# Altium project as14120.PrjPCB (part 1 of 2)
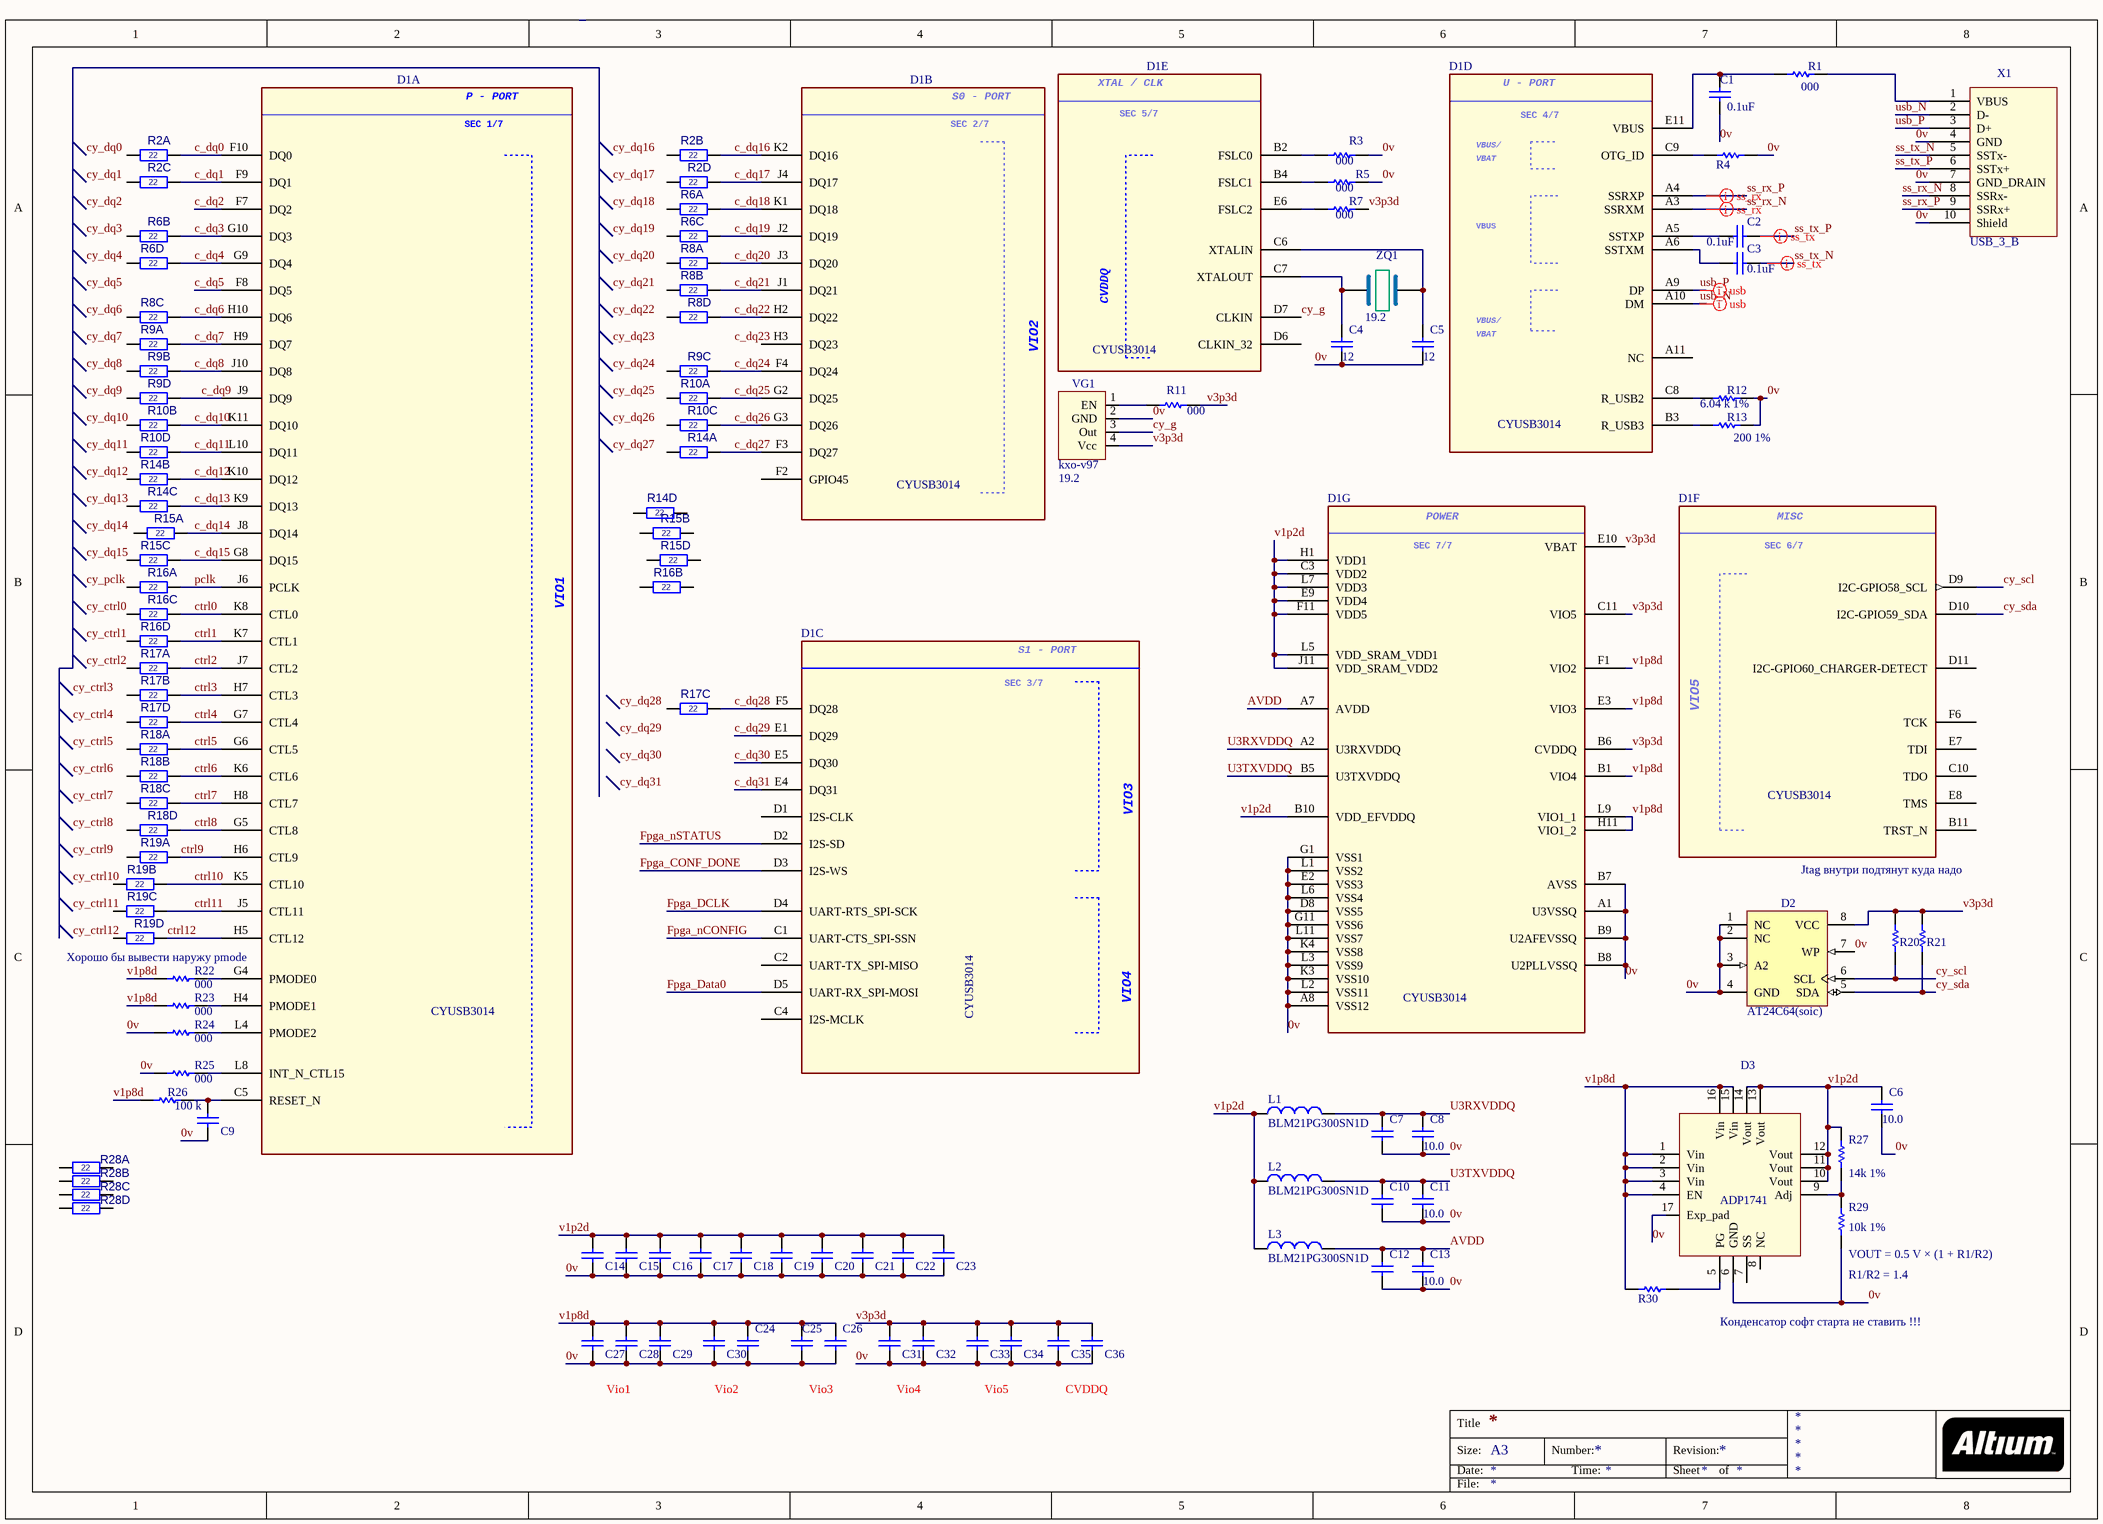
[diagram p0: as14120_usb.SchDoc]
7 sheets, 252 parts. Net scope: global (net labels, ports and power ports of the same name join across sheets).
Board file: as14120_all.PcbDoc
Sheets:
  as14120_usb.SchDoc
  as14120_ddr.SchDoc
  as14120_fpga_ttl.SchDoc
  as14120_fpga_ddr.SchDoc
  as14120_fpga_power_conf.SchDoc
  as14120_fpga_cypress.SchDoc
  as14120_fpga_adc.SchDoc

## Sheet as14120_usb.SchDoc
size A3; PageSetup: Record=PageOptions|CenterHorizontal=True|CenterVertical=True|PrintScale=0.91|XCorrection=1.00|YCorrection=1.00|PrintKind=0|BorderSize=5000000|LeftOffset=0|BottomOffset=0|Orientation=2|PaperLength=4200|PaperWidth=2970|Scale=100|PaperSource=7|PrintQuality=-4|MediaType=1|DitherType=10|PaperKind=A4 (210 x 297 мм)|PrintScaleMode=1

### Parts
C1  value 0.1uF  [CAPC0402(1005)60_M]  (hidden comment: CAP 1uF 10V 0402(1005))
C2  value 0.1uF  [CAPC0402(1005)60_M]  (hidden comment: CAP 1uF 10V 0402(1005))
C3  value 0.1uF  [CAPC0402(1005)60_M]  (hidden comment: CAP 1uF 10V 0402(1005))
C4  value 12  [CAPC0805(2012)100_N]  (hidden comment: CAP_0805)
C5  value 12  [CAPC0805(2012)100_N]  (hidden comment: CAP_0805)
C6  value 10.0  [CAPC0805(2012)100_N]  (hidden comment: CAP_0805)
C7  CAP 1uF 10V 0402(1005)  [CAPC0402(1005)60_M]  (value not drawn)
C8  value 10.0  [CAPC0805(2012)100_N]  (hidden comment: CAP_0805)
C9  CAP 1uF 10V 0402(1005)  [CAPC0402(1005)60_M]  (value not drawn)
C10  CAP 1uF 10V 0402(1005)  [CAPC0402(1005)60_M]  (value not drawn)
C11  value 10.0  [CAPC0805(2012)100_N]  (hidden comment: CAP_0805)
C12  CAP 1uF 10V 0402(1005)  [CAPC0402(1005)60_M]  (value not drawn)
C13  value 10.0  [CAPC0805(2012)100_N]  (hidden comment: CAP_0805)
C14  CAP 1uF 10V 0402(1005)  [CAPC0402(1005)60_M]  (value not drawn)
C15  CAP 1uF 10V 0402(1005)  [CAPC0402(1005)60_M]  (value not drawn)
C16  CAP 1uF 10V 0402(1005)  [CAPC0402(1005)60_M]  (value not drawn)
C17  CAP 1uF 10V 0402(1005)  [CAPC0402(1005)60_M]  (value not drawn)
C18  CAP 1uF 10V 0402(1005)  [CAPC0402(1005)60_M]  (value not drawn)
C19  CAP 1uF 10V 0402(1005)  [CAPC0402(1005)60_M]  (value not drawn)
C20  CAP 1uF 10V 0402(1005)  [CAPC0402(1005)60_M]  (value not drawn)
C21  CAP 1uF 10V 0402(1005)  [CAPC0402(1005)60_M]  (value not drawn)
C22  CAP 1uF 10V 0402(1005)  [CAPC0402(1005)60_M]  (value not drawn)
C23  CAP 1uF 10V 0402(1005)  [CAPC0402(1005)60_M]  (value not drawn)
C24  CAP 1uF 10V 0402(1005)  [CAPC0402(1005)60_M]  (value not drawn)
C25  CAP 1uF 10V 0402(1005)  [CAPC0402(1005)60_M]  (value not drawn)
C26  CAP 1uF 10V 0402(1005)  [CAPC0402(1005)60_M]  (value not drawn)
C27  CAP 1uF 10V 0402(1005)  [CAPC0402(1005)60_M]  (value not drawn)
C28  CAP 1uF 10V 0402(1005)  [CAPC0402(1005)60_M]  (value not drawn)
C29  CAP 1uF 10V 0402(1005)  [CAPC0402(1005)60_M]  (value not drawn)
C30  CAP 1uF 10V 0402(1005)  [CAPC0402(1005)60_M]  (value not drawn)
C31  CAP 1uF 10V 0402(1005)  [CAPC0402(1005)60_M]  (value not drawn)
C32  CAP 1uF 10V 0402(1005)  [CAPC0402(1005)60_M]  (value not drawn)
C33  CAP 1uF 10V 0402(1005)  [CAPC0402(1005)60_M]  (value not drawn)
C34  CAP 1uF 10V 0402(1005)  [CAPC0402(1005)60_M]  (value not drawn)
C35  CAP 1uF 10V 0402(1005)  [CAPC0402(1005)60_M]  (value not drawn)
C36  CAP 1uF 10V 0402(1005)  [CAPC0402(1005)60_M]  (value not drawn)
D1  CYUSB3014  [BGA121C80P11X11]  (parts A,B,C,D,E,F,G of 7)
D2  AT24C64(soic)  [8S1_N]
D3  ADP1741  [CP-16-4_N]
L1  BLM21PG300SN1D  [CAPC0805(2012)100_N]
L2  BLM21PG300SN1D  [CAPC0805(2012)100_N]
L3  BLM21PG300SN1D  [CAPC0805(2012)100_N]
R1  value 000  [RESC0805(2012)_L]  (hidden comment: 1K 1% 0805(2012))
R2  value 22  [CAY16]  (hidden comment: RES_CAY16)  (parts A,B,C,D of 4)
R3  value 000  [RESC0603(1608)_L]  (hidden comment: 1K 5% 0603(1608))
R4  ???  [RESC0603(1608)_L]  (value not drawn)
R5  value 000  [RESC0603(1608)_L]  (hidden comment: 1K 5% 0603(1608))
R6  value 22  [CAY16]  (hidden comment: RES_CAY16)  (parts A,B,C,D of 4)
R7  value 000  [RESC0603(1608)_L]  (hidden comment: 1K 5% 0603(1608))
R8  value 22  [CAY16]  (hidden comment: RES_CAY16)  (parts A,B,C,D of 4)
R9  value 22  [CAY16]  (hidden comment: RES_CAY16)  (parts A,B,C,D of 4)
R10  value 22  [CAY16]  (hidden comment: RES_CAY16)  (parts A,B,C,D of 4)
R11  value 000  [RESC0603(1608)_L]  (hidden comment: 1K 5% 0603(1608))
R12  value 6.04 k 1%  [RESC0805(2012)_L]  (hidden comment: 1K 1% 0805(2012))
R13  value 200 1%  [RESC0805(2012)_L]  (hidden comment: 1K 1% 0805(2012))
R14  value 22  [CAY16]  (hidden comment: RES_CAY16)  (parts A,B,C,D of 4)
R15  value 22  [CAY16]  (hidden comment: RES_CAY16)  (parts A,B,C,D of 4)
R16  value 22  [CAY16]  (hidden comment: RES_CAY16)  (parts A,B,C,D of 4)
R17  value 22  [CAY16]  (hidden comment: RES_CAY16)  (parts A,B,C,D of 4)
R18  value 22  [CAY16]  (hidden comment: RES_CAY16)  (parts A,B,C,D of 4)
R19  value 22  [CAY16]  (hidden comment: RES_CAY16)  (parts A,B,C,D of 4)
R20  1K 5% 0603(1608)  [RESC0603(1608)_L]  (value not drawn)
R21  1K 5% 0603(1608)  [RESC0603(1608)_L]  (value not drawn)
R22  value 000  [RESC0603(1608)_L]  (hidden comment: 1K 5% 0603(1608))
R23  value 000  [RESC0603(1608)_L]  (hidden comment: 1K 5% 0603(1608))
R24  value 000  [RESC0603(1608)_L]  (hidden comment: 1K 5% 0603(1608))
R25  value 000  [RESC0603(1608)_L]  (hidden comment: 1K 5% 0603(1608))
R26  value 100 k  [RESC0603(1608)_L]  (hidden comment: 1K 5% 0603(1608))
R27  value 14k 1%  [RESC0805(2012)_L]  (hidden comment: 1K 1% 0805(2012))
R28  value 22  [CAY16]  (hidden comment: RES_CAY16)  (parts A,B,C,D of 4)
R29  value 10k 1%  [RESC0805(2012)_L]  (hidden comment: 1K 1% 0805(2012))
R30  1K 5% 0603(1608)  [RESC0603(1608)_L]  (value not drawn)
VG1  kxo-v97  value 19.2  [kxo-v97]
X1  USB_3_B  [USB3_B]
ZQ1  value 19.2  [BCY-W2/E4.7]  (hidden comment: Resonator)

### Nets
0v: C1.2 C4.1 C5.1 C6.1 C7.1 C8.1 C9.1 C10.1 C11.1 C12.1 C13.1 C14.1 C15.1 C16.1 C17.1 C18.1 C19.1 C20.1 C21.1 C22.1 C23.1 C24.1 C25.1 C26.1 C27.1 C28.1 C29.1 C30.1 C31.1 C32.1 C33.1 C34.1 C35.1 C36.1 D1.A1(U3VSSQ) D1.A8(VSS12) D1.B7(AVSS) D1.B8(U2PLLVSSQ) D1.B9(U2AFEVSSQ) D1.D8(VSS5) D1.E2(VSS3) D1.G1(VSS1) D1.G11(VSS6) D1.K3(VSS10) D1.K4(VSS8) D1.L1(VSS2) D1.L2(VSS11) D1.L3(VSS9) D1.L6(VSS4) D1.L11(VSS7) D2.1(NC) D2.2(NC) D2.3(A2) D2.4(GND) D2.7(WP) D3.6(GND) D3.17(Exp_pad) R3.1 R4.2 R5.1 R12.2 R13.2 R24.2 R25.2 R29.1 VG1.2(GND) X1.4(GND) X1.7(GND_DRAIN) X1.10(Shield)
AVDD: C12.2 C13.2 D1.A7(AVDD) L3.2
c_dq0: D1.F10(DQ0) R2.8
c_dq1: D1.F9(DQ1) R2.6
c_dq2: D1.F7(DQ2)
c_dq3: D1.G10(DQ3) R6.7
c_dq4: D1.G9(DQ4) R6.8
c_dq5: D1.F8(DQ5)
c_dq6: D1.H10(DQ6) R8.6
c_dq7: D1.H9(DQ7) R9.8
c_dq8: D1.J10(DQ8) R9.7
c_dq9: D1.J9(DQ9) R9.8
c_dq10: D1.K11(DQ10) R10.7
c_dq11: D1.L10(DQ11) R10.8
c_dq12: D1.K10(DQ12) R14.7
c_dq13: D1.K9(DQ13) R14.6
c_dq14: D1.J8(DQ14) R15.8
c_dq15: D1.G8(DQ15) R15.7
c_dq16: D1.K2(DQ16) R2.7
c_dq17: D1.J4(DQ17) R2.5
c_dq18: D1.K1(DQ18) R6.8
c_dq19: D1.J2(DQ19) R6.6
c_dq20: D1.J3(DQ20) R8.7
c_dq21: D1.J1(DQ21) R8.6
c_dq22: D1.H2(DQ22) R8.5
c_dq24: D1.F4(DQ24) R9.7
c_dq25: D1.G2(DQ25) R10.8
c_dq26: D1.G3(DQ26) R10.6
c_dq27: D1.F3(DQ27) R14.8
c_dq28: D1.F5(DQ28) R17.6
c_dq29: D1.E1(DQ29)
c_dq30: D1.E5(DQ30)
c_dq31: D1.E4(DQ31)
ctrl0: D1.K8(CTL0) R16.6
ctrl1: D1.K7(CTL1) R16.5
ctrl2: D1.J7(CTL2) R17.8
ctrl3: D1.H7(CTL3) R17.7
ctrl4: D1.G7(CTL4) R17.5
ctrl5: D1.G6(CTL5) R18.8
ctrl6: D1.K6(CTL6) R18.7
ctrl7: D1.H8(CTL7) R18.7
ctrl8: D1.G5(CTL8) R18.5
ctrl9: D1.H6(CTL9) R19.5
ctrl10: D1.K5(CTL10) R19.7
ctrl11: D1.J5(CTL11) R19.6
ctrl12: D1.H5(CTL12) R19.5
cy_g: D1.D7(CLKIN) VG1.3(Out)
cy_scl: D1.D9(I2C-GPIO58_SCL) D2.6(SCL) R20.1
cy_sda: D1.D10(I2C-GPIO59_SDA) D2.5(SDA) R21.1
Fpga_CONF_DONE: D1.D3(I2S-WS)
Fpga_Data0: D1.D5(UART-RX_SPI-MOSI)
Fpga_DCLK: D1.D4(UART-RTS_SPI-SCK)
Fpga_nCONFIG: D1.C1(UART-CTS_SPI-SSN)
Fpga_nSTATUS: D1.D2(I2S-SD)
pclk: D1.J6(PCLK) R16.8
ss_rx_N: D1.A3(SSRXM) X1.8(SSRx-)
ss_rx_P: D1.A4(SSRXP) X1.9(SSRx+)
ss_tx_N: C3.1 X1.5(SSTx-)
ss_tx_P: C2.1 X1.6(SSTx+)
U3RXVDDQ: C7.2 C8.2 D1.A2(U3RXVDDQ) L1.2
U3TXVDDQ: C10.2 C11.2 D1.B5(U3TXVDDQ) L2.2
usb_N: D1.A10(DM) X1.2(D-)
usb_P: D1.A9(DP) X1.3(D+)
v1p2d: C6.2 C14.2 C15.2 C16.2 C17.2 C18.2 C19.2 C20.2 C21.2 C22.2 C23.2 D1.B10(VDD_EFVDDQ) D1.C3(VDD2) D1.E9(VDD4) D1.F11(VDD5) D1.H1(VDD1) D1.J11(VDD_SRAM_VDD2) D1.L5(VDD_SRAM_VDD1) D1.L7(VDD3) D3.10(Vout) D3.11(Vout) D3.12(Vout) D3.13(Vout) D3.14(Vout) L1.1 L2.1 L3.1 R27.2
v1p8d: C24.2 C25.2 C26.2 C27.2 C28.2 C29.2 C30.2 D1.B1(VIO4) D1.E3(VIO3) D1.F1(VIO2) D1.H11(VIO1_2) D1.L9(VIO1_1) D3.1(Vin) D3.2(Vin) D3.3(Vin) D3.4(EN) D3.15(Vin) D3.16(Vin) R22.2 R23.2 R26.2 R30.2
v3p3d: C31.2 C32.2 C33.2 C34.2 C35.2 C36.2 D1.B6(CVDDQ) D1.C11(VIO5) D1.E10(VBAT) D2.8(VCC) R7.1 R11.1 R20.2 R21.2 VG1.4(Vcc)
NetC1_1: C1.1 D1.E11(VBUS) R1.1
NetC2_2: C2.2 D1.A5(SSTXP)
NetC3_2: C3.2 D1.A6(SSTXM)
NetC4_2: C4.2 D1.C7(XTALOUT) ZQ1.1
NetC5_2: C5.2 D1.C6(XTALIN) ZQ1.2
NetC9_2: C9.2 D1.C5(RESET_N) R26.1
NetD1_B2: D1.B2(FSLC0) R3.2
NetD1_B3: D1.B3(R_USB3) R13.1
NetD1_B4: D1.B4(FSLC1) R5.2
NetD1_C8: D1.C8(R_USB2) R12.1
NetD1_C9: D1.C9(OTG_ID) R4.1
NetD1_E6: D1.E6(FSLC2) R7.2
NetD1_G4: D1.G4(PMODE0) R22.1
NetD1_H4: D1.H4(PMODE1) R23.1
NetD1_L4: D1.L4(PMODE2) R24.1
NetD1_L8: D1.L8(INT_N_CTL15) R25.1
NetD3_5: D3.5(PG) R30.1
NetD3_9: D3.9(Adj) R27.1 R29.2
NetR1_2: R1.2 X1.1(VBUS)
NetR11_2: R11.2 VG1.1(EN)

Not connected (* = marked no-connect by the designer): D1 A11(NC) B11(TRST_N) C2(UART-TX_SPI-MISO) C4(I2S-MCLK) C10(TDO) D1(I2S-CLK) D6(CLKIN_32) D11(I2C-GPIO60_CHARGER-DETECT) E7(TDI) E8(TMS) F2(GPIO45) F6(TCK) H3(DQ23); D3 7(SS) 8(NC); R2 1 2(1) 3(1) 4(1); R6 1 2(1) 3(1) 4(1); R8 1 2(1) 3(1) 4(1); R9 1 2(1) 3(1) 4(1); R10 1 2(1) 3(1) 4(1); R14 1 2(1) 3(1) 4(1) 5(2); R15 1 2(1) 3(1) 4(1) 5(2); R16 1 2(1) 3(1) 4(1) 7(2); R17 1 2(1) 3(1) 4(1); R18 1 2(1) 3(1) 4(1); R19 1 2(1) 3(1) 4(1); R28 1 2(1) 3(1) 4(1) 5(2) 6(2) 7(2) 8(2)

### Layout directives
differential pair: ss_rx_N, ss_rx_P, ss_tx_N, ss_tx_P, usb_N, usb_P

### Notes on the sheet
- Jtag внутри подтянут куда надо
- Хорошо бы вывести наружу pmode
- (near R29) VOUT = 0.5 V × (1 + R1/R2)
- R1/R2 = 1.4
- Конденсатор софт старта не ставить !!!
- Vio1
- Vio2
- Vio3
- Vio4
- Vio5
- CVDDQ
- Labels drawn without touching a wire or pin: c_dq23, cy_ctrl0, cy_ctrl1, cy_ctrl2, cy_ctrl3, cy_ctrl4, cy_ctrl5, cy_ctrl6, cy_ctrl7, cy_ctrl8, cy_ctrl9, cy_ctrl10, cy_ctrl11, cy_ctrl12, cy_dq0, cy_dq1, cy_dq2, cy_dq3, cy_dq4, cy_dq5, cy_dq6, cy_dq7, cy_dq8, cy_dq9, cy_dq10, cy_dq11, cy_dq12, cy_dq13, cy_dq14, cy_dq15, cy_dq16, cy_dq17, cy_dq18, cy_dq19, cy_dq20, cy_dq21, cy_dq22, cy_dq23, cy_dq24, cy_dq25, cy_dq26, cy_dq27, cy_dq28, cy_dq29, cy_dq30, cy_dq31, cy_pclk
- Title
- Size:
- Date:
- A3
- Number:
- Time:
- Revision:
- Sheet
- of
- File:
- (in symbol CYUSB3014-BZXC, part A) P - PORT; SEC 1/7; VIO1
- (in symbol CYUSB3014-BZXC, part B) S0 - PORT; SEC 2/7
- (in symbol CYUSB3014-BZXC, part C) S1 - PORT; SEC 3/7
- (in symbol CYUSB3014-BZXC, part D) U - PORT; SEC 4/7; VBUS/
- (in symbol CYUSB3014-BZXC, part E) XTAL / CLK; SEC 5/7
- (in symbol CYUSB3014-BZXC, part F) MISC; SEC 6/7
- (in symbol CYUSB3014-BZXC, part G) POWER; SEC 7/7

### Library data of the parts
C1-C3 C7 C9 C10 C12 C14-C36 = CAP_0402: CAP 1uF 10V ±20% 0402 (1005 Metric) Thickness 0.6mm SMD; Case-Metric: 1005; Case-EIA: 0402; Tolerance: ±20%; Max Thickness: 0.6 mm; Rated Voltage: 10 V; Technology: SMT
  C7 C9 C10 C12 C14-C36: Value: 1uF
D1 = CYUSB3014-BZXC
D2 = AT24C08BN-SP25-T: 8Kbit (1024 x 8), 2-wire Bus Automotive Serial EEPROM with Write Protect, 2.5V, 8-Pin SOIC, Tape & Reel; DatasheetVersion: 8517C,  Jan-2009; PackageVersion: revC, Mar-2005; PackageReference: 8S1; PackageDescription: 8-Lead (0.150" Wide Body), Plastic Gull Wing Small Outline (JEDEC SOIC); Code_JEDEC: MS-012-AA; Code_IPC: SOIC127P600-8; ComponentLink1Description: Manufacturer URL; ComponentLink1URL: http://www.atmel.com/; ComponentLink2Description: Datasheet; ComponentLink2URL: http://www.atmel.com/dyn/resources/prod_documents/doc8517.pdf
L1-L3 = Ferrite_beat
R1 R12 R13 R27 R29 = RES_0805: 1K 0.125W 1% 0805 (2012 Metric)  SMD; Case-Metric: 2012; Case-EIA: 0805; Tolerance: 1 %; Power: 0.125 W; Technology: SMT
R3-R5 R7 R11 R22-R26 = RES_0603: 1K 0.1W 5% 0603 (1608 Metric)  SMD; Case-EIA: 0603; Case-Metric: 1608; Technology: SMT; Tolerance: 5 %; Power: 0.1 W
  R4: Value: ???
R20 R21 = RES_0603: 1K 0.1W 5% 0603 (1608 Metric)  SMD; Case-EIA: 0603; Case-Metric: 1608; Value: 2.2 k; Technology: SMT; Tolerance: 5 %; Power: 0.1 W
R30 = RES_0603: 1K 0.1W 5% 0603 (1608 Metric)  SMD; Case-EIA: 0603; Case-Metric: 1608; Value: 100k; Technology: SMT; Tolerance: 5 %; Power: 0.1 W

## Sheet as14120_ddr.SchDoc
size A3; PageSetup: Record=PageOptions|CenterHorizontal=True|CenterVertical=True|PrintScale=1.56|XCorrection=1.00|YCorrection=1.00|PrintKind=0|BorderSize=5000000|LeftOffset=0|BottomOffset=0|Orientation=2|PaperLength=3060|PaperWidth=2190|Scale=100|PaperSource=7|PrintQuality=-4|MediaType=1|DitherType=10|PaperKind=A4 (без полей) (210 x 297 мм)|PrintScaleMode=1
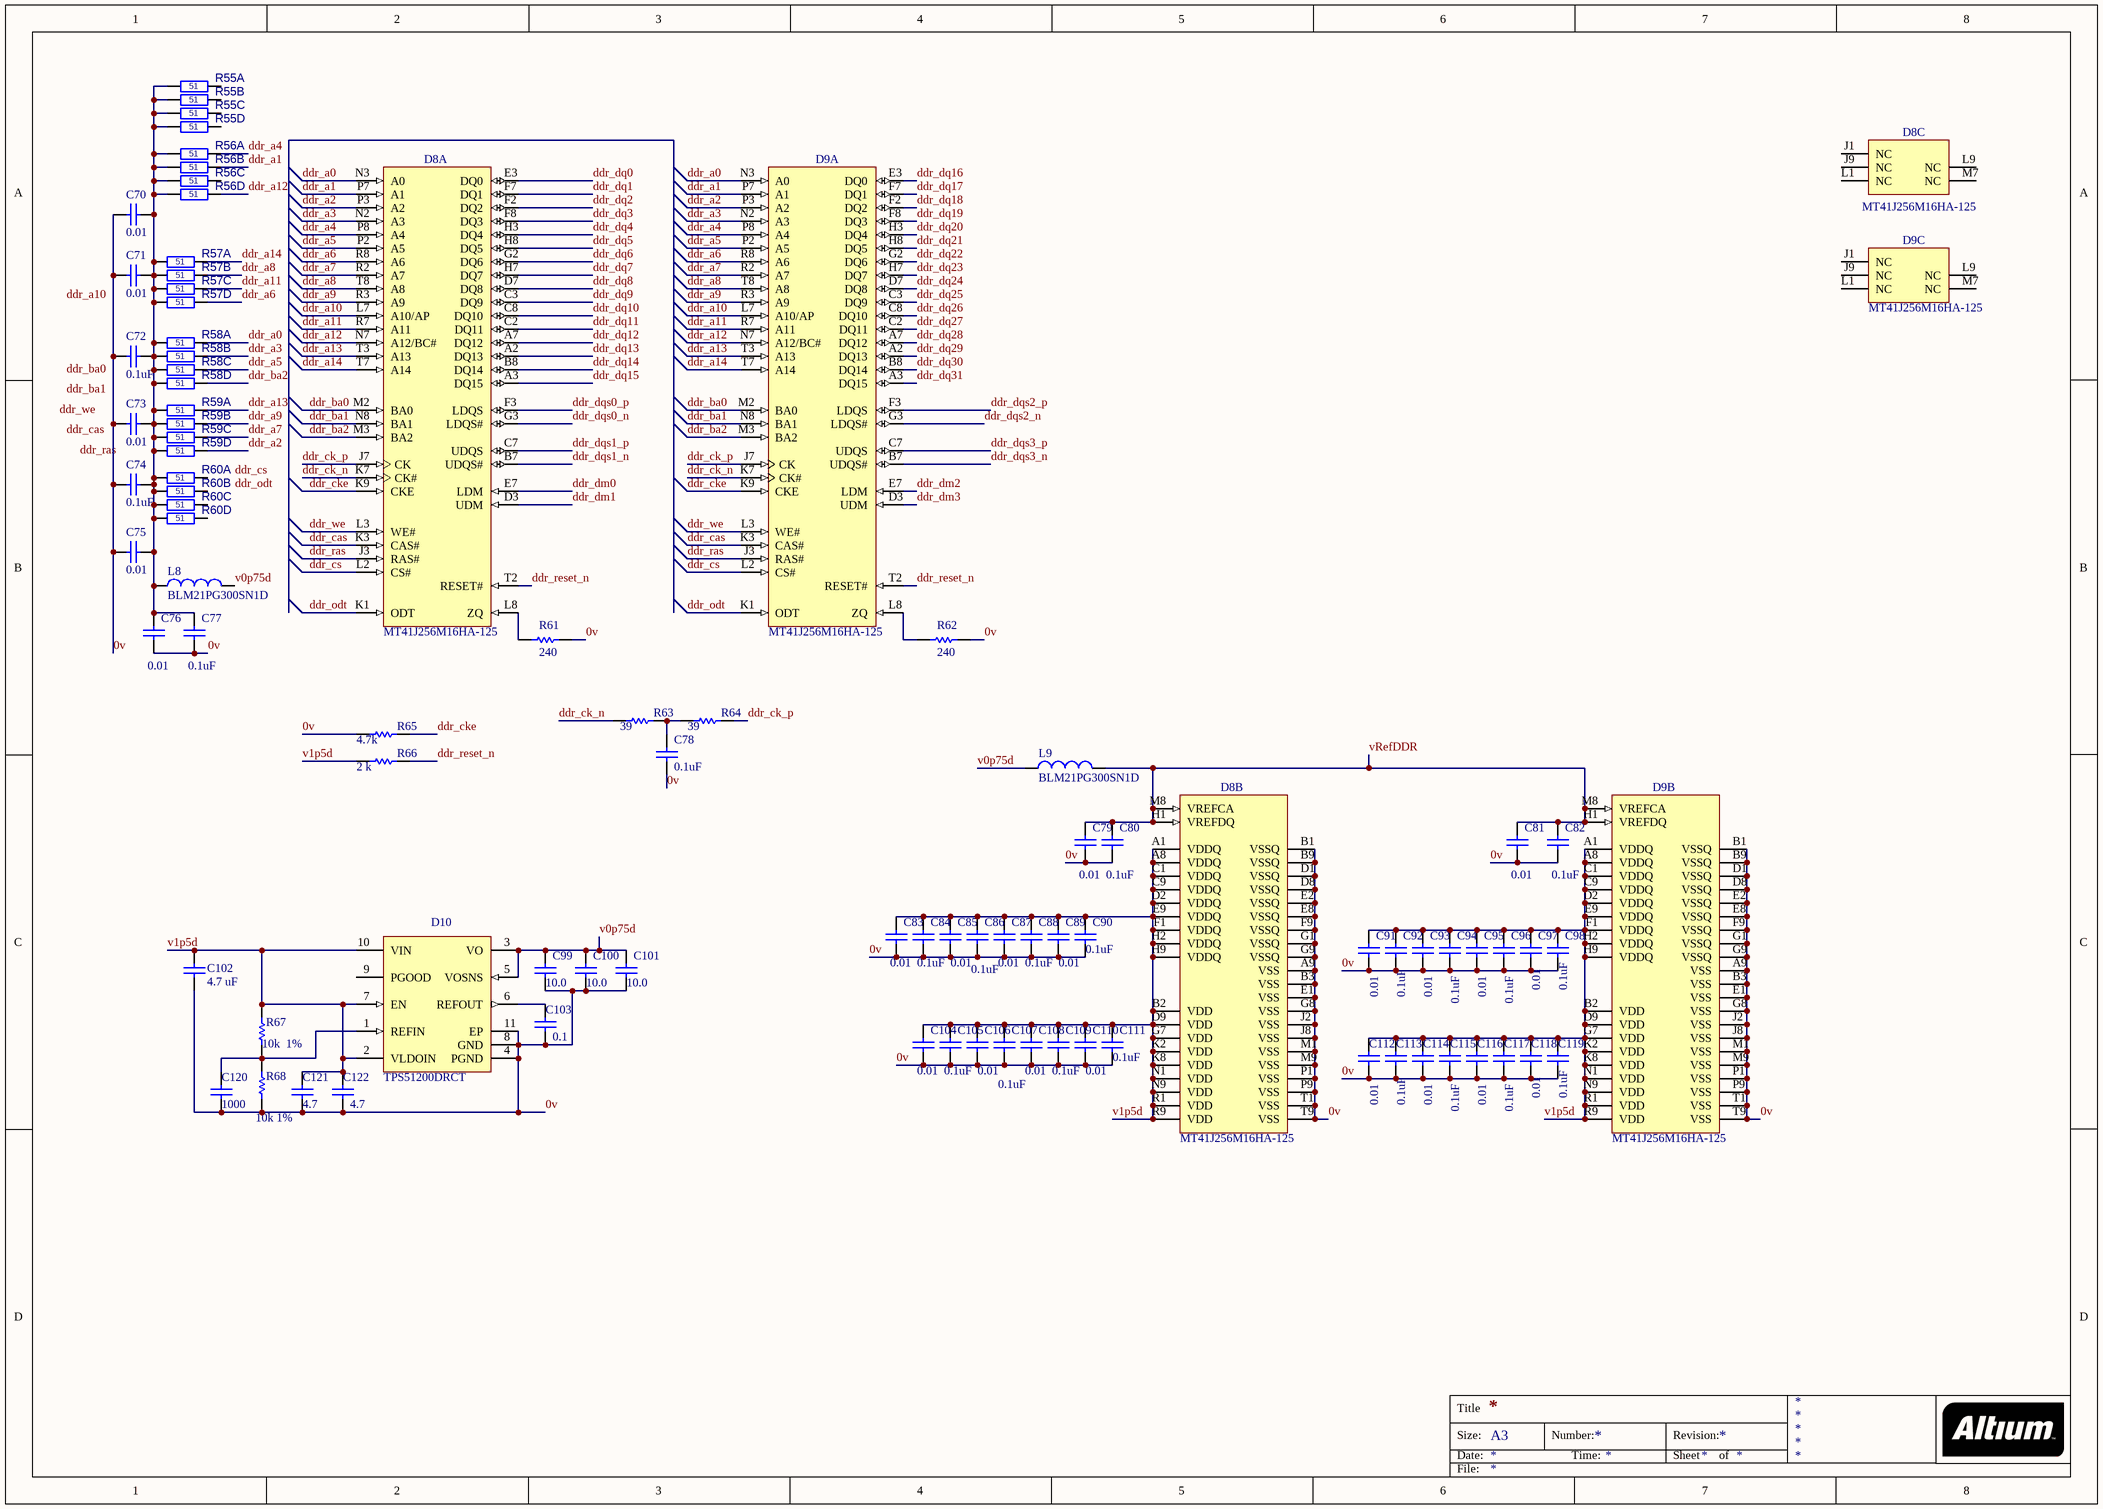
[diagram p1: as14120_ddr.SchDoc]

### Parts
C70  value 0.01  [CAPC0402(1005)60_M]  (hidden comment: CAP 1uF 10V 0402(1005))
C71  value 0.01  [CAPC0402(1005)60_M]  (hidden comment: CAP 1uF 10V 0402(1005))
C72  value 0.1uF  [CAPC0402(1005)60_M]  (hidden comment: CAP 1uF 10V 0402(1005))
C73  value 0.01  [CAPC0402(1005)60_M]  (hidden comment: CAP 1uF 10V 0402(1005))
C74  value 0.1uF  [CAPC0402(1005)60_M]  (hidden comment: CAP 1uF 10V 0402(1005))
C75  value 0.01  [CAPC0402(1005)60_M]  (hidden comment: CAP 1uF 10V 0402(1005))
C76  value 0.01  [CAPC0402(1005)60_M]  (hidden comment: CAP 1uF 10V 0402(1005))
C77  value 0.1uF  [CAPC0402(1005)60_M]  (hidden comment: CAP 1uF 10V 0402(1005))
C78  value 0.1uF  [CAPC0402(1005)60_M]  (hidden comment: CAP 1uF 10V 0402(1005))
C79  value 0.01  [CAPC0402(1005)60_M]  (hidden comment: CAP 1uF 10V 0402(1005))
C80  value 0.1uF  [CAPC0402(1005)60_M]  (hidden comment: CAP 1uF 10V 0402(1005))
C81  value 0.01  [CAPC0402(1005)60_M]  (hidden comment: CAP 1uF 10V 0402(1005))
C82  value 0.1uF  [CAPC0402(1005)60_M]  (hidden comment: CAP 1uF 10V 0402(1005))
C83  value 0.01  [CAPC0402(1005)60_M]  (hidden comment: CAP 1uF 10V 0402(1005))
C84  value 0.1uF  [CAPC0402(1005)60_M]  (hidden comment: CAP 1uF 10V 0402(1005))
C85  value 0.01  [CAPC0402(1005)60_M]  (hidden comment: CAP 1uF 10V 0402(1005))
C86  value 0.1uF  [CAPC0402(1005)60_M]  (hidden comment: CAP 1uF 10V 0402(1005))
C87  value 0.01  [CAPC0402(1005)60_M]  (hidden comment: CAP 1uF 10V 0402(1005))
C88  value 0.1uF  [CAPC0402(1005)60_M]  (hidden comment: CAP 1uF 10V 0402(1005))
C89  value 0.01  [CAPC0402(1005)60_M]  (hidden comment: CAP 1uF 10V 0402(1005))
C90  value 0.1uF  [CAPC0402(1005)60_M]  (hidden comment: CAP 1uF 10V 0402(1005))
C91  value 0.01  [CAPC0402(1005)60_M]  (hidden comment: CAP 1uF 10V 0402(1005))
C92  value 0.1uF  [CAPC0402(1005)60_M]  (hidden comment: CAP 1uF 10V 0402(1005))
C93  value 0.01  [CAPC0402(1005)60_M]  (hidden comment: CAP 1uF 10V 0402(1005))
C94  value 0.1uF  [CAPC0402(1005)60_M]  (hidden comment: CAP 1uF 10V 0402(1005))
C95  value 0.01  [CAPC0402(1005)60_M]  (hidden comment: CAP 1uF 10V 0402(1005))
C96  value 0.1uF  [CAPC0402(1005)60_M]  (hidden comment: CAP 1uF 10V 0402(1005))
C97  value 0.01  [CAPC0402(1005)60_M]  (hidden comment: CAP 1uF 10V 0402(1005))
C98  value 0.1uF  [CAPC0402(1005)60_M]  (hidden comment: CAP 1uF 10V 0402(1005))
C99  value 10.0  [CAPC0805(2012)100_N]  (hidden comment: CAP_0805)
C100  value 10.0  [CAPC0805(2012)100_N]  (hidden comment: CAP_0805)
C101  value 10.0  [CAPC0805(2012)100_N]  (hidden comment: CAP_0805)
C102  value 4.7 uF  [CAPC0805(2012)100_N]  (hidden comment: CAP_0805)
C103  value 0.1  [CAPC0805(2012)100_N]  (hidden comment: CAP_0805)
C104  value 0.01  [CAPC0402(1005)60_M]  (hidden comment: CAP 1uF 10V 0402(1005))
C105  value 0.1uF  [CAPC0402(1005)60_M]  (hidden comment: CAP 1uF 10V 0402(1005))
C106  value 0.01  [CAPC0402(1005)60_M]  (hidden comment: CAP 1uF 10V 0402(1005))
C107  value 0.1uF  [CAPC0402(1005)60_M]  (hidden comment: CAP 1uF 10V 0402(1005))
C108  value 0.01  [CAPC0402(1005)60_M]  (hidden comment: CAP 1uF 10V 0402(1005))
C109  value 0.1uF  [CAPC0402(1005)60_M]  (hidden comment: CAP 1uF 10V 0402(1005))
C110  value 0.01  [CAPC0402(1005)60_M]  (hidden comment: CAP 1uF 10V 0402(1005))
C111  value 0.1uF  [CAPC0402(1005)60_M]  (hidden comment: CAP 1uF 10V 0402(1005))
C112  value 0.01  [CAPC0402(1005)60_M]  (hidden comment: CAP 1uF 10V 0402(1005))
C113  value 0.1uF  [CAPC0402(1005)60_M]  (hidden comment: CAP 1uF 10V 0402(1005))
C114  value 0.01  [CAPC0402(1005)60_M]  (hidden comment: CAP 1uF 10V 0402(1005))
C115  value 0.1uF  [CAPC0402(1005)60_M]  (hidden comment: CAP 1uF 10V 0402(1005))
C116  value 0.01  [CAPC0402(1005)60_M]  (hidden comment: CAP 1uF 10V 0402(1005))
C117  value 0.1uF  [CAPC0402(1005)60_M]  (hidden comment: CAP 1uF 10V 0402(1005))
C118  value 0.01  [CAPC0402(1005)60_M]  (hidden comment: CAP 1uF 10V 0402(1005))
C119  value 0.1uF  [CAPC0402(1005)60_M]  (hidden comment: CAP 1uF 10V 0402(1005))
C120  value 1000  [CAPC0805(2012)100_N]  (hidden comment: CAP_0805)
C121  value 4.7  [CAPC0805(2012)100_N]  (hidden comment: CAP_0805)
C122  value 4.7  [CAPC0805(2012)100_N]  (hidden comment: CAP_0805)
D8  MT41J256M16HA-125  [MICT-HA-96]  (parts A,B,C of 3)
D9  MT41J256M16HA-125  [MICT-HA-96]  (parts A,B,C of 3)
D10  TPS51200DRCT  [TI-DRC10-2400X1650TP_V]
L8  BLM21PG300SN1D  [CAPC0805(2012)100_N]
L9  BLM21PG300SN1D  [CAPC0805(2012)100_N]
R55  value 51  [CAY16]  (hidden comment: RES_CAY16)  (parts A,B,C,D of 4)
R56  value 51  [CAY16]  (hidden comment: RES_CAY16)  (parts A,B,C,D of 4)
R57  value 51  [CAY16]  (hidden comment: RES_CAY16)  (parts A,B,C,D of 4)
R58  value 51  [CAY16]  (hidden comment: RES_CAY16)  (parts A,B,C,D of 4)
R59  value 51  [CAY16]  (hidden comment: RES_CAY16)  (parts A,B,C,D of 4)
R60  value 51  [CAY16]  (hidden comment: RES_CAY16)  (parts A,B,C,D of 4)
R61  value 240  [RESC0805(2012)_L]  (hidden comment: 1K 1% 0805(2012))
R62  value 240  [RESC0805(2012)_L]  (hidden comment: 1K 1% 0805(2012))
R63  39  [RESC0805(2012)_L]
R64  39  [RESC0805(2012)_L]
R65  value 4.7k  [RESC0805(2012)_L]  (hidden comment: 1K 1% 0805(2012))
R66  value 2 k  [RESC0805(2012)_L]  (hidden comment: 1K 1% 0805(2012))
R67  value 10k  1%  [RESC0805(2012)_L]  (hidden comment: 1K 1% 0805(2012))
R68  value 10k 1%  [RESC0805(2012)_L]  (hidden comment: 1K 1% 0805(2012))

### Nets
0v: C70.2 C71.2 C72.2 C73.2 C74.2 C75.2 C76.1 C77.1 C78.1 C79.1 C80.1 C81.1 C82.1 C83.1 C84.1 C85.1 C86.1 C87.1 C88.1 C89.1 C90.1 C91.1 C92.1 C93.1 C94.1 C95.1 C96.1 C97.1 C98.1 C99.1 C100.1 C101.1 C102.1 C103.1 C104.1 C105.1 C106.1 C107.1 C108.1 C109.1 C110.1 C111.1 C112.1 C113.1 C114.1 C115.1 C116.1 C117.1 C118.1 C119.1 C120.1 C121.1 C122.1 D8.A9(VSS) D8.B1(VSSQ) D8.B3(VSS) D8.B9(VSSQ) D8.D1(VSSQ) D8.D8(VSSQ) D8.E1(VSS) D8.E2(VSSQ) D8.E8(VSSQ) D8.F9(VSSQ) D8.G1(VSSQ) D8.G8(VSS) D8.G9(VSSQ) D8.J2(VSS) D8.J8(VSS) D8.M1(VSS) D8.M9(VSS) D8.P1(VSS) D8.P9(VSS) D8.T1(VSS) D8.T9(VSS) D9.A9(VSS) D9.B1(VSSQ) D9.B3(VSS) D9.B9(VSSQ) D9.D1(VSSQ) D9.D8(VSSQ) D9.E1(VSS) D9.E2(VSSQ) D9.E8(VSSQ) D9.F9(VSSQ) D9.G1(VSSQ) D9.G8(VSS) D9.G9(VSSQ) D9.J2(VSS) D9.J8(VSS) D9.M1(VSS) D9.M9(VSS) D9.P1(VSS) D9.P9(VSS) D9.T1(VSS) D9.T9(VSS) D10.4(PGND) D10.8(GND) D10.11(EP) R61.2 R62.2 R65.1 R68.1
ddr_a0: D8.N3(A0) D9.N3(A0) R58.6
ddr_a1: D8.P7(A1) D9.P7(A1) R56.5
ddr_a2: D8.P3(A2) D9.P3(A2) R59.5
ddr_a3: D8.N2(A3) D9.N2(A3) R58.5
ddr_a4: D8.P8(A4) D9.P8(A4) R56.6
ddr_a5: D8.P2(A5) D9.P2(A5) R58.8
ddr_a6: D8.R8(A6) D9.R8(A6) R57.7
ddr_a7: D8.R2(A7) D9.R2(A7) R59.6
ddr_a8: D8.T8(A8) D9.T8(A8) R57.8
ddr_a9: D8.R3(A9) D9.R3(A9) R59.7
ddr_a10: D8.L7(A10/AP) D9.L7(A10/AP)
ddr_a11: D8.R7(A11) D9.R7(A11) R57.5
ddr_a12: D8.N7(A12/BC#) D9.N7(A12/BC#) R56.7
ddr_a13: D8.T3(A13) D9.T3(A13) R59.8
ddr_a14: D8.T7(A14) D9.T7(A14) R57.6
ddr_ba0: D8.M2(BA0) D9.M2(BA0)
ddr_ba1: D8.N8(BA1) D9.N8(BA1)
ddr_ba2: D8.M3(BA2) D9.M3(BA2) R58.7
ddr_cas: D8.K3(CAS#) D9.K3(CAS#)
ddr_ck_n: D8.K7(CK#) D9.K7(CK#) R63.1
ddr_ck_p: D8.J7(CK) D9.J7(CK) R64.2
ddr_cke: D8.K9(CKE) D9.K9(CKE) R65.2
ddr_cs: D8.L2(CS#) D9.L2(CS#)
ddr_dm0: D8.E7(LDM)
ddr_dm1: D8.D3(UDM)
ddr_dm2: D9.E7(LDM)
ddr_dm3: D9.D3(UDM)
ddr_dq0: D8.E3(DQ0)
ddr_dq1: D8.F7(DQ1)
ddr_dq2: D8.F2(DQ2)
ddr_dq3: D8.F8(DQ3)
ddr_dq4: D8.H3(DQ4)
ddr_dq5: D8.H8(DQ5)
ddr_dq6: D8.G2(DQ6)
ddr_dq7: D8.H7(DQ7)
ddr_dq8: D8.D7(DQ8)
ddr_dq9: D8.C3(DQ9)
ddr_dq10: D8.C8(DQ10)
ddr_dq11: D8.C2(DQ11)
ddr_dq12: D8.A7(DQ12)
ddr_dq13: D8.A2(DQ13)
ddr_dq14: D8.B8(DQ14)
ddr_dq15: D8.A3(DQ15)
ddr_dq16: D9.E3(DQ0)
ddr_dq17: D9.F7(DQ1)
ddr_dq18: D9.F2(DQ2)
ddr_dq19: D9.F8(DQ3)
ddr_dq20: D9.H3(DQ4)
ddr_dq21: D9.H8(DQ5)
ddr_dq22: D9.G2(DQ6)
ddr_dq23: D9.H7(DQ7)
ddr_dq24: D9.D7(DQ8)
ddr_dq25: D9.C3(DQ9)
ddr_dq26: D9.C8(DQ10)
ddr_dq27: D9.C2(DQ11)
ddr_dq28: D9.A7(DQ12)
ddr_dq29: D9.A2(DQ13)
ddr_dq30: D9.B8(DQ14)
ddr_dq31: D9.A3(DQ15)
ddr_dqs0_n: D8.G3(LDQS#)
ddr_dqs0_p: D8.F3(LDQS)
ddr_dqs1_n: D8.B7(UDQS#)
ddr_dqs1_p: D8.C7(UDQS)
ddr_dqs2_n: D9.G3(LDQS#)
ddr_dqs2_p: D9.F3(LDQS)
ddr_dqs3_n: D9.B7(UDQS#)
ddr_dqs3_p: D9.C7(UDQS)
ddr_odt: D8.K1(ODT) D9.K1(ODT)
ddr_ras: D8.J3(RAS#) D9.J3(RAS#)
ddr_reset_n: D8.T2(RESET#) D9.T2(RESET#) R66.2
ddr_we: D8.L3(WE#) D9.L3(WE#)
v0p75d: C99.2 C100.2 C101.2 D10.3(VO) D10.5(VOSNS) L8.2 L9.1
v1p5d: C83.2 C84.2 C85.2 C86.2 C87.2 C88.2 C89.2 C90.2 C91.2 C92.2 C93.2 C94.2 C95.2 C96.2 C97.2 C98.2 C102.2 C104.2 C105.2 C106.2 C107.2 C108.2 C109.2 C110.2 C111.2 C112.2 C113.2 C114.2 C115.2 C116.2 C117.2 C118.2 C119.2 C121.2 C122.2 D8.A1(VDDQ) D8.A8(VDDQ) D8.B2(VDD) D8.C1(VDDQ) D8.C9(VDDQ) D8.D2(VDDQ) D8.D9(VDD) D8.E9(VDDQ) D8.F1(VDDQ) D8.G7(VDD) D8.H2(VDDQ) D8.H9(VDDQ) D8.K2(VDD) D8.K8(VDD) D8.N1(VDD) D8.N9(VDD) D8.R1(VDD) D8.R9(VDD) D9.A1(VDDQ) D9.A8(VDDQ) D9.B2(VDD) D9.C1(VDDQ) D9.C9(VDDQ) D9.D2(VDDQ) D9.D9(VDD) D9.E9(VDDQ) D9.F1(VDDQ) D9.G7(VDD) D9.H2(VDDQ) D9.H9(VDDQ) D9.K2(VDD) D9.K8(VDD) D9.N1(VDD) D9.N9(VDD) D9.R1(VDD) D9.R9(VDD) D10.2(VLDOIN) D10.7(EN) D10.10(VIN) R66.1 R67.2
vRefDDR: C79.2 C80.2 C81.2 C82.2 D8.H1(VREFDQ) D8.M8(VREFCA) D9.H1(VREFDQ) D9.M8(VREFCA) L9.2
NetC70_1: C70.1 C71.1 C72.1 C73.1 C74.1 C75.1 C76.2 C77.2 L8.1 R55.1 R55.2 R55.3 R55.4 R56.1 R56.2 R56.3 R56.4 R57.1 R57.2 R57.3 R57.4 R58.1 R58.2 R58.3 R58.4 R59.1 R59.2 R59.3 R59.4 R60.1 R60.2 R60.3 R60.4
NetC78_2: C78.2 R63.2 R64.1
NetC103_2: C103.2 D10.6(REFOUT)
NetC120_2: C120.2 D10.1(REFIN) R67.1 R68.2
NetD8_L8: D8.L8(ZQ) R61.1
NetD9_L8: D9.L8(ZQ) R62.1

Not connected (* = marked no-connect by the designer): D8 J1(NC) J9(NC) L1(NC) L9(NC) M7(NC); D9 J1(NC) J9(NC) L1(NC) L9(NC) M7(NC); D10 9(PGOOD); R55 5(2) 6(2) 7(2) 8(2); R56 8(2); R60 5(2) 6(2) 7(2) 8(2)

### Notes on the sheet
- Labels drawn without touching a wire or pin: ddr_a10, ddr_ba0, ddr_ba1, ddr_cas, ddr_cs, ddr_odt, ddr_ras, ddr_we
- Title
- Size:
- Date:
- A3
- Number:
- Time:
- Revision:
- Sheet
- of
- File:

### Library data of the parts
C70-C98 C104-C119 = CAP_0402: as C1 on sheet as14120_usb; Tolerance: ±20%; Max Thickness: 0.6 mm; Rated Voltage: 10 V; Technology: SMT
D8 D9 = MT41J256M16HA-125: 4Gb DDR3-1600 SDRAM, 256Mb x 16, 1.25ns, 1.5V, 0 to 95 degC, 96-Ball FBGA, Pb-Free; Manufacturer: Micron; CL: CL = 11; Clock Rate: 800 MHz; Op. Temp.: 0C to +95C; DatasheetVersion: Rev.J; PackageVersion: Rev.E; PackageReference: MICT-HA-96; PackageDescription: 96-Ball Fine-Pitch Ball Grid Array, 14 x 9 mm, Pitch 0.8 mm; Cycle Time: 1.25ns; Data Rate: DDR3-1600; Density: 4Gb; Depth: 256Mb; Package: FBGA; Pin Count: 96-ball; RoHS: Yes; Voltage: 1.5V; Width: x16; Mounting Technology: Surface Mount; PartNumber: MT41J256M16HA-125; ComponentLink1Description: Manufacturer URL; ComponentLink1URL: http://www.micron.com/; ComponentLink2Description: Datasheet; ComponentLink2URL: http://www.micron.com/~/media/Documents/Products/Data%20Sheet/DRAM/4Gb_DDR3_SDRAM.pdf; ComponentLink3Description: Package Specification; ComponentLink3URL: http://www.micron.com/~/media/Documents/Products/Data%20Sheet/DRAM/4Gb_1_35V_DDR3L.pdf
D10 = TPS51200DRCT: Single Output LDO, 3 A, 2.375 to 3.5 V Input, with DDR Termination, 10-pin SON (DRC), -40 to 85 degC, Green (RoHS & no Sb/Br); Manufacturer: Texas Instruments; Iout(Max)(A): 3; Iq(Typ)(mA): 0.5; Power Good: TRUE; Rating: Catalog; SubFamily: Single Channel LDO; Vin(Max)(V): 3.5; Vin(Min)(V): 2.3; DatasheetVersion: SLUS812; PackageVersion: 4204102-3/L; PackageReference: DRC10-2400X1650TP; PackageDescription: 10-Pin Plastic Small Outline, Body 3 x 3 mm, Pitch 0.5 mm; Supplier 1: Digi-Key; Supplier Part Number 1: 296-23830-2-ND; Supplier 2: Digi-Key; Supplier Part Number 2: 296-23830-1-ND; Supplier 3: Digi-Key; Supplier Part Number 3: 296-23830-6-ND; Supplier 4: Farnell; Supplier Part Number 4: 1903398; Supplier 5: Newark; Supplier Part Number 5: 01P3287; Supplier 6: Newark; Supplier Part Number 6: 11N9833; Supplier 7: Mouser; Supplier Part Number 7: 595-TPS51200DRCT; Eco-Plan: Green (RoHS & no Sb/Br); Mounting Technology: Surface Mount; PartNumber: TPS51200DRCT; ComponentLink1Description: Manufacturer URL; ComponentLink1URL: http://www.ti.com/; ComponentLink2Description: Datasheet; ComponentLink2URL: http://www.ti.com/general/docs/lit/getliterature.tsp?genericPartNumber=TPS51200&fileType=pdf; ComponentLink3Description: Package Specification; ComponentLink3URL: http://www.ti.com/litv/pdf/mpds117k; ComponentLink4Description: URL Link1; ComponentLink4URL: Samples URL:http://www.ti.com/product/tps51200#samples
L8 L9 = Ferrite_beat
R61-R68 = RES_0805: as R1 on sheet as14120_usb; Tolerance: 1 %; Power: 0.125 W; Technology: SMT
  R63 R64: Value: 39

## Sheet as14120_fpga_ttl.SchDoc
size A3; PageSetup: Record=PageOptions|CenterHorizontal=True|CenterVertical=True|PrintScale=1.00|XCorrection=1.00|YCorrection=1.00|PrintKind=1|BorderSize=5000000|LeftOffset=0|BottomOffset=0|Orientation=2|PaperLength=1000|PaperWidth=1000|Scale=100|PaperSource=7|PrintQuality=-4|MediaType=1|DitherType=10|PaperKind=A4 (210 x 297 мм)|PrintScaleMode=1
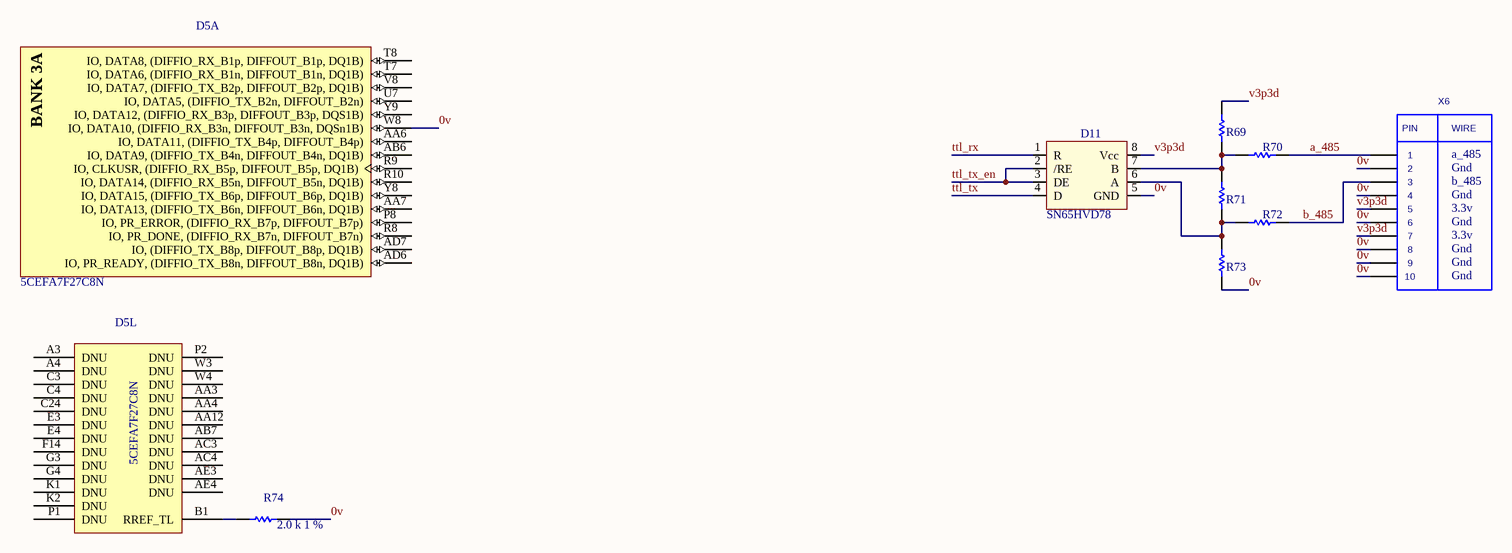
[diagram p2: as14120_fpga_ttl.SchDoc]

### Parts
D5  5CEFA7F27C8N  [ALTR-672-FBGA-2000A]  (parts A,L of 12)
D11  SN65HVD78  [8S1_M]
R69  1K 1% 0805(2012)  [RESC0805(2012)_L]  (value not drawn)
R70  1K 1% 0805(2012)  [RESC0805(2012)_L]  (value not drawn)
R71  1K 1% 0805(2012)  [RESC0805(2012)_L]  (value not drawn)
R72  1K 1% 0805(2012)  [RESC0805(2012)_L]  (value not drawn)
R73  1K 1% 0805(2012)  [RESC0805(2012)_L]  (value not drawn)
R74  value 2.0 k  Tolerance: 1 %  [RESC0805(2012)_L]  (hidden comment: 1K 1% 0805(2012))
X6  IDC10  [IDC10M]  (value not drawn)

### Nets
0v: D5.W8(IO,_DATA10,_(DIFFIO_RX_B3n,_DIFFOUT_B3n,_DQSn1B)) D11.5(GND) R73.1 R74.2 X6.2 X6.4 X6.6 X6.8 X6.9 X6.10
a_485: R70.2 X6.1
b_485: R72.2 X6.3
ttl_rx: D11.1(R)
ttl_tx: D11.4(D)
ttl_tx_en: D11.2(/RE) D11.3(DE)
v3p3d: D11.8(Vcc) R69.2 X6.5 X6.7
NetD5_B1: D5.B1(RREF_TL) R74.1
NetD11_6: D11.6(A) R71.1 R72.1 R73.2
NetD11_7: D11.7(B) R69.1 R70.1 R71.2

Not connected (* = marked no-connect by the designer): D5 A3(DNU) A4(DNU) AA3(DNU) AA4(DNU) AA6(IO,_DATA11,_(DIFFIO_TX_B4p,_DIFFOUT_B4p)) AA7(IO,_DATA13,_(DIFFIO_TX_B6n,_DIFFOUT_B6n,_DQ1B)) AA12(DNU) AB6(IO,_DATA9,_(DIFFIO_TX_B4n,_DIFFOUT_B4n,_DQ1B)) AB7(DNU) AC3(DNU) AC4(DNU) AD6(IO,_PR_READY,_(DIFFIO_TX_B8n,_DIFFOUT_B8n,_DQ1B)) AD7(IO,_(DIFFIO_TX_B8p,_DIFFOUT_B8p,_DQ1B)) AE3(DNU) AE4(DNU) C3(DNU) C4(DNU) C24(DNU) E3(DNU) E4(DNU) F14(DNU) G3(DNU) G4(DNU) K1(DNU) K2(DNU) P1(DNU) P2(DNU) P8(IO,_PR_ERROR,_(DIFFIO_RX_B7p,_DIFFOUT_B7p)) R8(IO,_PR_DONE,_(DIFFIO_RX_B7n,_DIFFOUT_B7n)) R9(IO,_CLKUSR,_(DIFFIO_RX_B5p,_DIFFOUT_B5p,_DQ1B)) R10(IO,_DATA14,_(DIFFIO_RX_B5n,_DIFFOUT_B5n,_DQ1B)) T7(IO,_DATA6,_(DIFFIO_RX_B1n,_DIFFOUT_B1n,_DQ1B)) T8(IO,_DATA8,_(DIFFIO_RX_B1p,_DIFFOUT_B1p,_DQ1B)) U7(IO,_DATA5,_(DIFFIO_TX_B2n,_DIFFOUT_B2n)) V8(IO,_DATA7,_(DIFFIO_TX_B2p,_DIFFOUT_B2p,_DQ1B)) W3(DNU) W4(DNU) Y8(IO,_DATA15,_(DIFFIO_TX_B6p,_DIFFOUT_B6p,_DQ1B)) Y9(IO,_DATA12,_(DIFFIO_RX_B3p,_DIFFOUT_B3p,_DQS1B))

### Notes on the sheet
- a_485
- b_485
- 3.3v
- Gnd
- Title
- Size:
- Date:
- A3
- Number:
- Time:
- Revision:
- Sheet
- of
- File:
- (in symbol 5CEFA7F27C8N, part A) BANK 3A
- (in symbol IDC10) PIN; WIRE

### Library data of the parts
D5 = 5CEFA7F27C8N: Cyclone V E Family FPGA, 1.07 to 1.13 V Supply, 336 I/O Pins, 7 PLLs, 672-Pin FBGA, Speed Grade 8, Commercial Grade, RoHS Compliant; Manufacturer: Altera; Device Group: 5CEFA7; GPIO: 336; Logic Elements (LE) (K): 149.5; Speed Grade: 8; DatasheetVersion: Rev. 3.1; PackageReference: 672-FBGA-2000A; PackageDescription: 672-Pin FineLine Ball-Grid Array (FBGA), Body 27 x 27 mm, Pitch 1 mm; Supplier 1: Digi-Key; Supplier Part Number 1: 5CEFA7F27C8N-ND; Supplier 2: Mouser; Supplier Part Number 2: 989-5CEFA7F27C8N; RoHS: RoHS Compliant; Subcategory: Cyclone V E; Voltage Supply: 1.07 to 1.13 V; Mounting Technology: Surface Mount; Code_JEDEC: MS-034-AAL-1; PartNumber: 5CEFA7F27C8N; ComponentLink1Description: Manufacturer URL; ComponentLink1URL: http://www.altera.com; ComponentLink2Description: Datasheet; ComponentLink2URL: http://www.altera.com/literature/hb/cyclone-v/cv_51002.pdf; ComponentLink3Description: Package Specification; ComponentLink3URL: http://www.altera.com/devicepackaging/04R00427-01.pdf; ComponentLink4Description: Device Handbook URL; ComponentLink4URL: http://www.altera.com/literature/hb/cyclone-v/cyclone5_handbook.pdf; ComponentLink5Description: Device Overview URL; ComponentLink5URL: http://www.altera.com/literature/hb/cyclone-v/cv_51001.pdf; ComponentLink6Description: Device Pin-Out URL; ComponentLink6URL: http://www.altera.com/literature/dp/cyclone-v/1.1.txt; ComponentLink7Description: Product URL; ComponentLink7URL: http://www.buyaltera.com/scripts/partsearch.dll?Detail&name=5CEFA7F27C8N-ND
R69 R73 = RES_0805: 1K 0.125W 1% 0805 (2012 Metric)  SMD; Case-Metric: 2012; Value: 1.1 k; Case-EIA: 0805; Tolerance: 1 %; Power: 0.125 W; Technology: SMT
R70 R72 = RES_0805: 1K 0.125W 1% 0805 (2012 Metric)  SMD; Case-Metric: 2012; Value: 33; Case-EIA: 0805; Tolerance: 1 %; Power: 0.125 W; Technology: SMT
R71 = RES_0805: 1K 0.125W 1% 0805 (2012 Metric)  SMD; Case-Metric: 2012; Value: 120; Case-EIA: 0805; Tolerance: 1 %; Power: 0.125 W; Technology: SMT
R74 = RES_0805: as R1 on sheet as14120_usb; Power: 0.125 W; Technology: SMT
X6 = IDC10: Value: *

## Sheet as14120_fpga_ddr.SchDoc
size A3; PageSetup: Record=PageOptions|CenterHorizontal=True|CenterVertical=True|PrintScale=1.02|XCorrection=1.00|YCorrection=1.00|PrintKind=1|BorderSize=5000000|LeftOffset=0|BottomOffset=0|Orientation=2|PaperLength=4200|PaperWidth=2970|Scale=100|PaperSource=7|PrintQuality=-4|MediaType=1|DitherType=10|PaperKind=A3 (бумага продольной резки) (297 x 420 мм)|PrintScaleMode=1
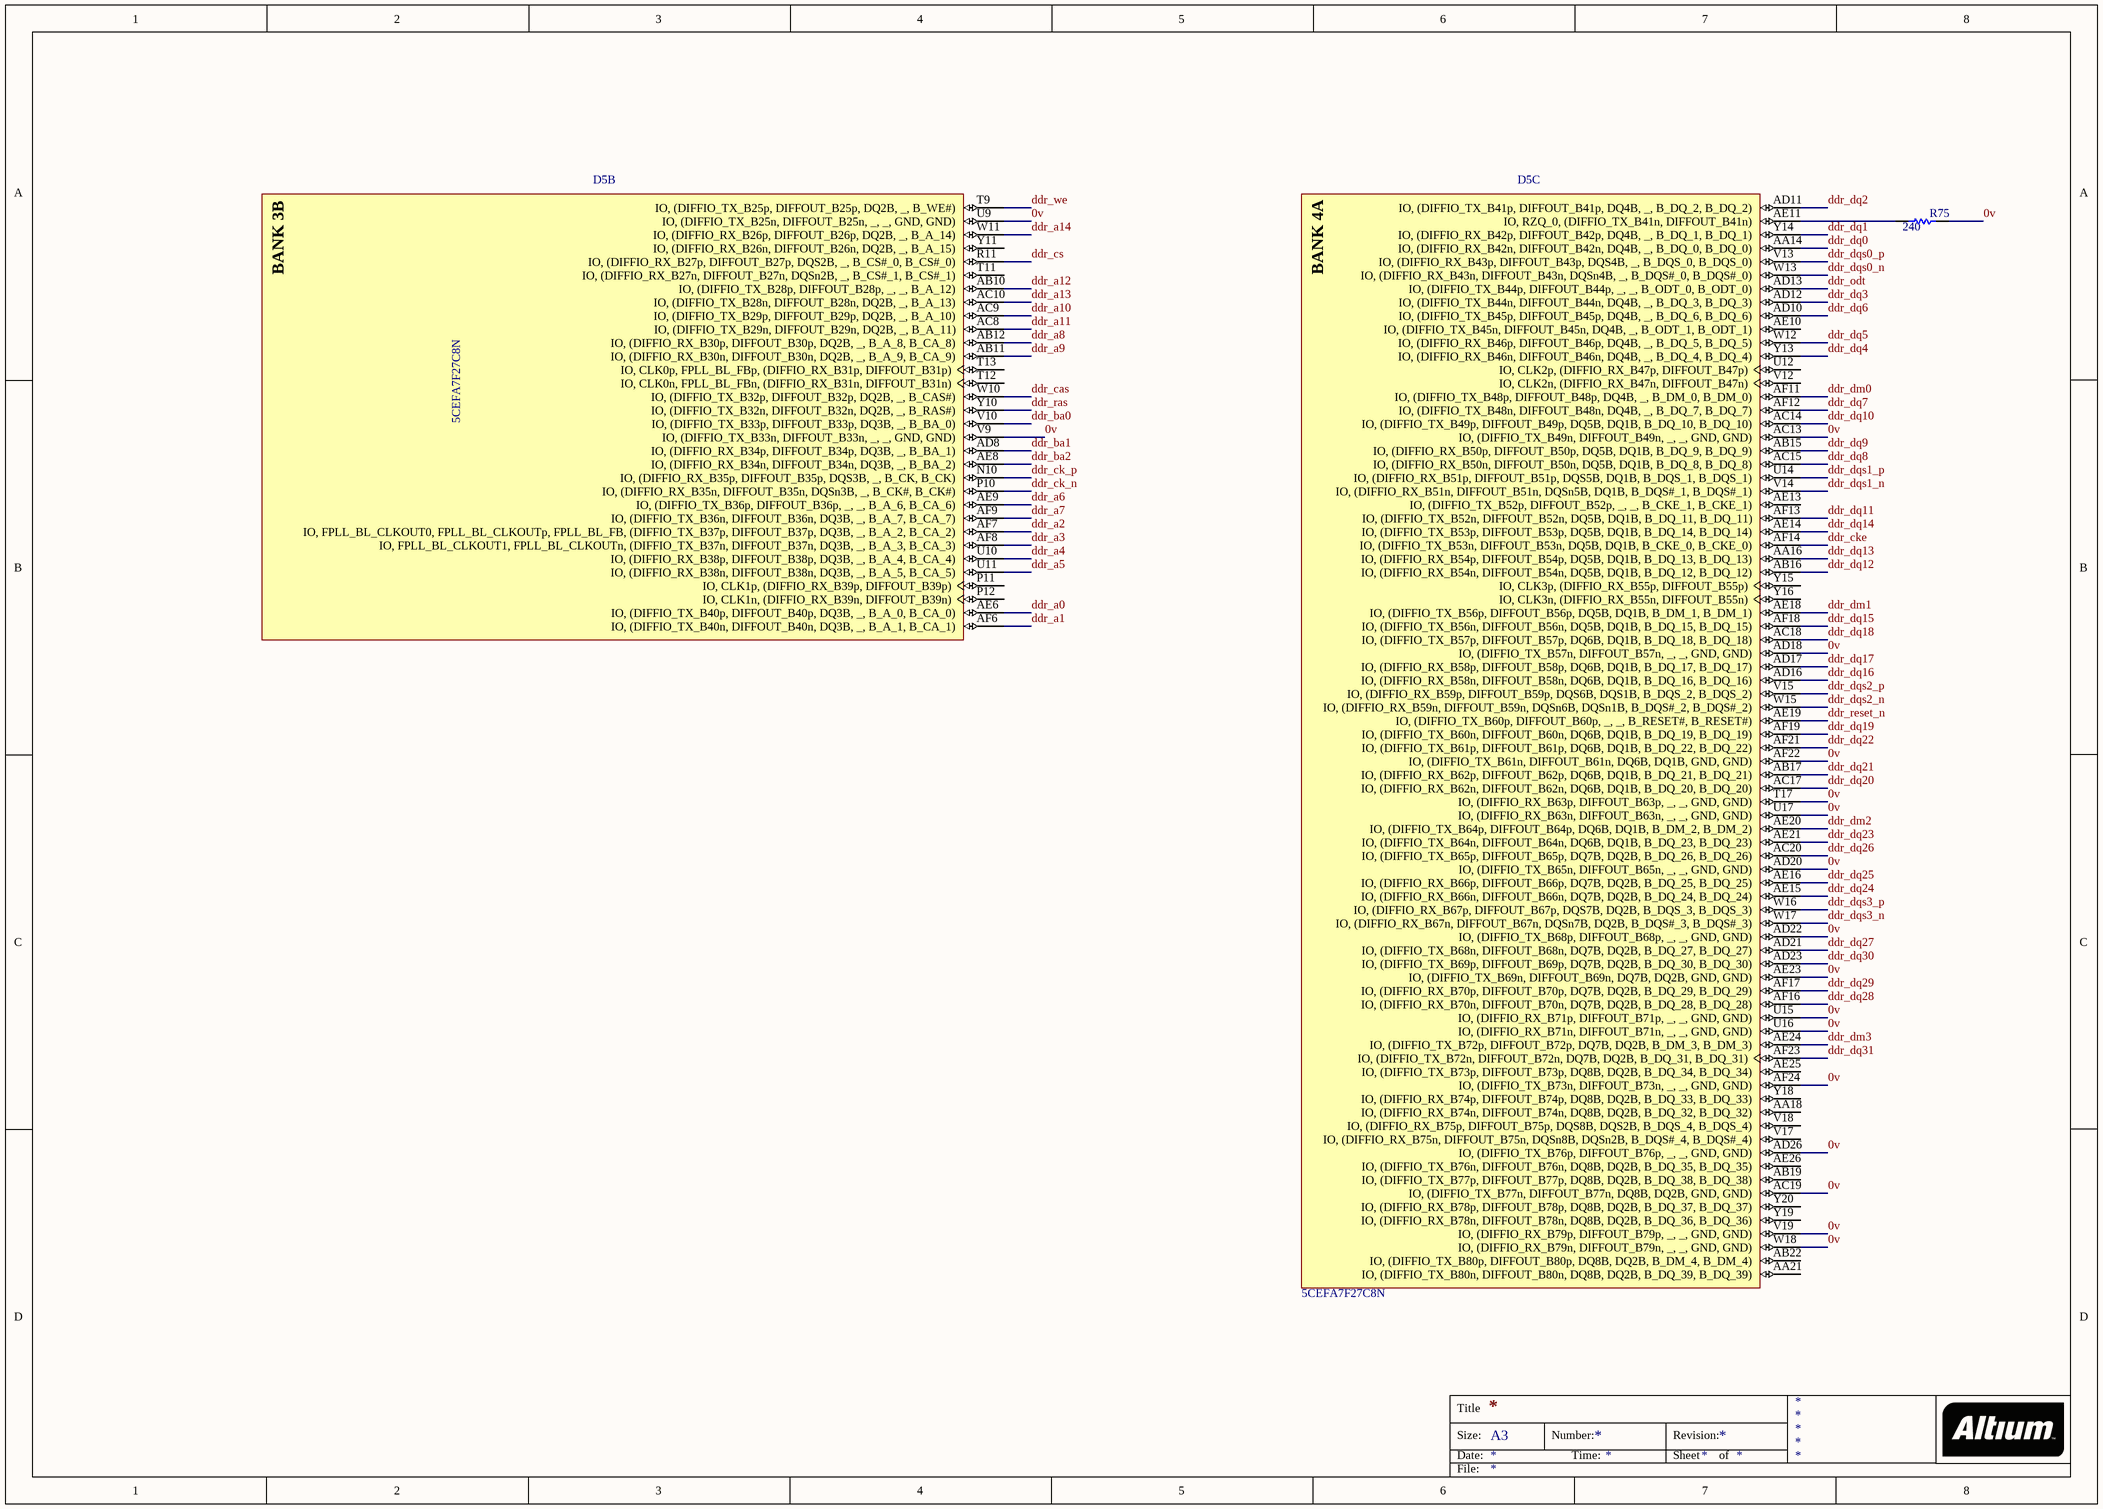
[diagram p3: as14120_fpga_ddr.SchDoc]

### Parts
D5  5CEFA7F27C8N  [ALTR-672-FBGA-2000A]  (parts B,C of 12)
R75  value 240  [RESC0805(2012)_L]  (hidden comment: 1K 1% 0805(2012))

### Nets
0v: D5.AC13(IO,_(DIFFIO_TX_B49n,_DIFFOUT_B49n,__,__,_GND,_GND)) D5.AC19(IO,_(DIFFIO_TX_B77n,_DIFFOUT_B77n,_DQ8B,_DQ2B,_GND,_GND)) D5.AD18(IO,_(DIFFIO_TX_B57n,_DIFFOUT_B57n,__,__,_GND,_GND)) D5.AD20(IO,_(DIFFIO_TX_B65n,_DIFFOUT_B65n,__,__,_GND,_GND)) D5.AD22(IO,_(DIFFIO_TX_B68p,_DIFFOUT_B68p,__,__,_GND,_GND)) D5.AD26(IO,_(DIFFIO_TX_B76p,_DIFFOUT_B76p,__,__,_GND,_GND)) D5.AE23(IO,_(DIFFIO_TX_B69n,_DIFFOUT_B69n,_DQ7B,_DQ2B,_GND,_GND)) D5.AF22(IO,_(DIFFIO_TX_B61n,_DIFFOUT_B61n,_DQ6B,_DQ1B,_GND,_GND)) D5.AF24(IO,_(DIFFIO_TX_B73n,_DIFFOUT_B73n,__,__,_GND,_GND)) D5.T17(IO,_(DIFFIO_RX_B63p,_DIFFOUT_B63p,__,__,_GND,_GND)) D5.U9(IO,_(DIFFIO_TX_B25n,_DIFFOUT_B25n,__,__,_GND,_GND)) D5.U15(IO,_(DIFFIO_RX_B71p,_DIFFOUT_B71p,__,__,_GND,_GND)) D5.U16(IO,_(DIFFIO_RX_B71n,_DIFFOUT_B71n,__,__,_GND,_GND)) D5.U17(IO,_(DIFFIO_RX_B63n,_DIFFOUT_B63n,__,__,_GND,_GND)) D5.V9(IO,_(DIFFIO_TX_B33n,_DIFFOUT_B33n,__,__,_GND,_GND)) D5.V19(IO,_(DIFFIO_RX_B79p,_DIFFOUT_B79p,__,__,_GND,_GND)) D5.W18(IO,_(DIFFIO_RX_B79n,_DIFFOUT_B79n,__,__,_GND,_GND)) R75.2
ddr_a0: D5.AE6(IO,_(DIFFIO_TX_B40p,_DIFFOUT_B40p,_DQ3B,__,_B_A_0,_B_CA_0))
ddr_a1: D5.AF6(IO,_(DIFFIO_TX_B40n,_DIFFOUT_B40n,_DQ3B,__,_B_A_1,_B_CA_1))
ddr_a2: D5.AF7(IO,_FPLL_BL_CLKOUT0,_FPLL_BL_CLKOUTp,_FPLL_BL_FB,_(DIFFIO_TX_B37p,_DIFFOUT_B37p,_DQ3B,__,_B_A_2,_B_CA_2))
ddr_a3: D5.AF8(IO,_FPLL_BL_CLKOUT1,_FPLL_BL_CLKOUTn,_(DIFFIO_TX_B37n,_DIFFOUT_B37n,_DQ3B,__,_B_A_3,_B_CA_3))
ddr_a4: D5.U10(IO,_(DIFFIO_RX_B38p,_DIFFOUT_B38p,_DQ3B,__,_B_A_4,_B_CA_4))
ddr_a5: D5.U11(IO,_(DIFFIO_RX_B38n,_DIFFOUT_B38n,_DQ3B,__,_B_A_5,_B_CA_5))
ddr_a6: D5.AE9(IO,_(DIFFIO_TX_B36p,_DIFFOUT_B36p,__,__,_B_A_6,_B_CA_6))
ddr_a7: D5.AF9(IO,_(DIFFIO_TX_B36n,_DIFFOUT_B36n,_DQ3B,__,_B_A_7,_B_CA_7))
ddr_a8: D5.AB12(IO,_(DIFFIO_RX_B30p,_DIFFOUT_B30p,_DQ2B,__,_B_A_8,_B_CA_8))
ddr_a9: D5.AB11(IO,_(DIFFIO_RX_B30n,_DIFFOUT_B30n,_DQ2B,__,_B_A_9,_B_CA_9))
ddr_a10: D5.AC9(IO,_(DIFFIO_TX_B29p,_DIFFOUT_B29p,_DQ2B,__,_B_A_10))
ddr_a11: D5.AC8(IO,_(DIFFIO_TX_B29n,_DIFFOUT_B29n,_DQ2B,__,_B_A_11))
ddr_a12: D5.AB10(IO,_(DIFFIO_TX_B28p,_DIFFOUT_B28p,__,__,_B_A_12))
ddr_a13: D5.AC10(IO,_(DIFFIO_TX_B28n,_DIFFOUT_B28n,_DQ2B,__,_B_A_13))
ddr_a14: D5.W11(IO,_(DIFFIO_RX_B26p,_DIFFOUT_B26p,_DQ2B,__,_B_A_14))
ddr_ba0: D5.V10(IO,_(DIFFIO_TX_B33p,_DIFFOUT_B33p,_DQ3B,__,_B_BA_0))
ddr_ba1: D5.AD8(IO,_(DIFFIO_RX_B34p,_DIFFOUT_B34p,_DQ3B,__,_B_BA_1))
ddr_ba2: D5.AE8(IO,_(DIFFIO_RX_B34n,_DIFFOUT_B34n,_DQ3B,__,_B_BA_2))
ddr_cas: D5.W10(IO,_(DIFFIO_TX_B32p,_DIFFOUT_B32p,_DQ2B,__,_B_CAS#))
ddr_ck_n: D5.P10(IO,_(DIFFIO_RX_B35n,_DIFFOUT_B35n,_DQSn3B,__,_B_CK#,_B_CK#))
ddr_ck_p: D5.N10(IO,_(DIFFIO_RX_B35p,_DIFFOUT_B35p,_DQS3B,__,_B_CK,_B_CK))
ddr_cke: D5.AF14(IO,_(DIFFIO_TX_B53n,_DIFFOUT_B53n,_DQ5B,_DQ1B,_B_CKE_0,_B_CKE_0))
ddr_cs: D5.R11(IO,_(DIFFIO_RX_B27p,_DIFFOUT_B27p,_DQS2B,__,_B_CS#_0,_B_CS#_0))
ddr_dm0: D5.AF11(IO,_(DIFFIO_TX_B48p,_DIFFOUT_B48p,_DQ4B,__,_B_DM_0,_B_DM_0))
ddr_dm1: D5.AE18(IO,_(DIFFIO_TX_B56p,_DIFFOUT_B56p,_DQ5B,_DQ1B,_B_DM_1,_B_DM_1))
ddr_dm2: D5.AE20(IO,_(DIFFIO_TX_B64p,_DIFFOUT_B64p,_DQ6B,_DQ1B,_B_DM_2,_B_DM_2))
ddr_dm3: D5.AE24(IO,_(DIFFIO_TX_B72p,_DIFFOUT_B72p,_DQ7B,_DQ2B,_B_DM_3,_B_DM_3))
ddr_dq0: D5.AA14(IO,_(DIFFIO_RX_B42n,_DIFFOUT_B42n,_DQ4B,__,_B_DQ_0,_B_DQ_0))
ddr_dq1: D5.Y14(IO,_(DIFFIO_RX_B42p,_DIFFOUT_B42p,_DQ4B,__,_B_DQ_1,_B_DQ_1))
ddr_dq2: D5.AD11(IO,_(DIFFIO_TX_B41p,_DIFFOUT_B41p,_DQ4B,__,_B_DQ_2,_B_DQ_2))
ddr_dq3: D5.AD12(IO,_(DIFFIO_TX_B44n,_DIFFOUT_B44n,_DQ4B,__,_B_DQ_3,_B_DQ_3))
ddr_dq4: D5.Y13(IO,_(DIFFIO_RX_B46n,_DIFFOUT_B46n,_DQ4B,__,_B_DQ_4,_B_DQ_4))
ddr_dq5: D5.W12(IO,_(DIFFIO_RX_B46p,_DIFFOUT_B46p,_DQ4B,__,_B_DQ_5,_B_DQ_5))
ddr_dq6: D5.AD10(IO,_(DIFFIO_TX_B45p,_DIFFOUT_B45p,_DQ4B,__,_B_DQ_6,_B_DQ_6))
ddr_dq7: D5.AF12(IO,_(DIFFIO_TX_B48n,_DIFFOUT_B48n,_DQ4B,__,_B_DQ_7,_B_DQ_7))
ddr_dq8: D5.AC15(IO,_(DIFFIO_RX_B50n,_DIFFOUT_B50n,_DQ5B,_DQ1B,_B_DQ_8,_B_DQ_8))
ddr_dq9: D5.AB15(IO,_(DIFFIO_RX_B50p,_DIFFOUT_B50p,_DQ5B,_DQ1B,_B_DQ_9,_B_DQ_9))
ddr_dq10: D5.AC14(IO,_(DIFFIO_TX_B49p,_DIFFOUT_B49p,_DQ5B,_DQ1B,_B_DQ_10,_B_DQ_10))
ddr_dq11: D5.AF13(IO,_(DIFFIO_TX_B52n,_DIFFOUT_B52n,_DQ5B,_DQ1B,_B_DQ_11,_B_DQ_11))
ddr_dq12: D5.AB16(IO,_(DIFFIO_RX_B54n,_DIFFOUT_B54n,_DQ5B,_DQ1B,_B_DQ_12,_B_DQ_12))
ddr_dq13: D5.AA16(IO,_(DIFFIO_RX_B54p,_DIFFOUT_B54p,_DQ5B,_DQ1B,_B_DQ_13,_B_DQ_13))
ddr_dq14: D5.AE14(IO,_(DIFFIO_TX_B53p,_DIFFOUT_B53p,_DQ5B,_DQ1B,_B_DQ_14,_B_DQ_14))
ddr_dq15: D5.AF18(IO,_(DIFFIO_TX_B56n,_DIFFOUT_B56n,_DQ5B,_DQ1B,_B_DQ_15,_B_DQ_15))
ddr_dq16: D5.AD16(IO,_(DIFFIO_RX_B58n,_DIFFOUT_B58n,_DQ6B,_DQ1B,_B_DQ_16,_B_DQ_16))
ddr_dq17: D5.AD17(IO,_(DIFFIO_RX_B58p,_DIFFOUT_B58p,_DQ6B,_DQ1B,_B_DQ_17,_B_DQ_17))
ddr_dq18: D5.AC18(IO,_(DIFFIO_TX_B57p,_DIFFOUT_B57p,_DQ6B,_DQ1B,_B_DQ_18,_B_DQ_18))
ddr_dq19: D5.AF19(IO,_(DIFFIO_TX_B60n,_DIFFOUT_B60n,_DQ6B,_DQ1B,_B_DQ_19,_B_DQ_19))
ddr_dq20: D5.AC17(IO,_(DIFFIO_RX_B62n,_DIFFOUT_B62n,_DQ6B,_DQ1B,_B_DQ_20,_B_DQ_20))
ddr_dq21: D5.AB17(IO,_(DIFFIO_RX_B62p,_DIFFOUT_B62p,_DQ6B,_DQ1B,_B_DQ_21,_B_DQ_21))
ddr_dq22: D5.AF21(IO,_(DIFFIO_TX_B61p,_DIFFOUT_B61p,_DQ6B,_DQ1B,_B_DQ_22,_B_DQ_22))
ddr_dq23: D5.AE21(IO,_(DIFFIO_TX_B64n,_DIFFOUT_B64n,_DQ6B,_DQ1B,_B_DQ_23,_B_DQ_23))
ddr_dq24: D5.AE15(IO,_(DIFFIO_RX_B66n,_DIFFOUT_B66n,_DQ7B,_DQ2B,_B_DQ_24,_B_DQ_24))
ddr_dq25: D5.AE16(IO,_(DIFFIO_RX_B66p,_DIFFOUT_B66p,_DQ7B,_DQ2B,_B_DQ_25,_B_DQ_25))
ddr_dq26: D5.AC20(IO,_(DIFFIO_TX_B65p,_DIFFOUT_B65p,_DQ7B,_DQ2B,_B_DQ_26,_B_DQ_26))
ddr_dq27: D5.AD21(IO,_(DIFFIO_TX_B68n,_DIFFOUT_B68n,_DQ7B,_DQ2B,_B_DQ_27,_B_DQ_27))
ddr_dq28: D5.AF16(IO,_(DIFFIO_RX_B70n,_DIFFOUT_B70n,_DQ7B,_DQ2B,_B_DQ_28,_B_DQ_28))
ddr_dq29: D5.AF17(IO,_(DIFFIO_RX_B70p,_DIFFOUT_B70p,_DQ7B,_DQ2B,_B_DQ_29,_B_DQ_29))
ddr_dq30: D5.AD23(IO,_(DIFFIO_TX_B69p,_DIFFOUT_B69p,_DQ7B,_DQ2B,_B_DQ_30,_B_DQ_30))
ddr_dq31: D5.AF23(IO,_(DIFFIO_TX_B72n,_DIFFOUT_B72n,_DQ7B,_DQ2B,_B_DQ_31,_B_DQ_31))
ddr_dqs0_n: D5.W13(IO,_(DIFFIO_RX_B43n,_DIFFOUT_B43n,_DQSn4B,__,_B_DQS#_0,_B_DQS#_0))
ddr_dqs0_p: D5.V13(IO,_(DIFFIO_RX_B43p,_DIFFOUT_B43p,_DQS4B,__,_B_DQS_0,_B_DQS_0))
ddr_dqs1_n: D5.V14(IO,_(DIFFIO_RX_B51n,_DIFFOUT_B51n,_DQSn5B,_DQ1B,_B_DQS#_1,_B_DQS#_1))
ddr_dqs1_p: D5.U14(IO,_(DIFFIO_RX_B51p,_DIFFOUT_B51p,_DQS5B,_DQ1B,_B_DQS_1,_B_DQS_1))
ddr_dqs2_n: D5.W15(IO,_(DIFFIO_RX_B59n,_DIFFOUT_B59n,_DQSn6B,_DQSn1B,_B_DQS#_2,_B_DQS#_2))
ddr_dqs2_p: D5.V15(IO,_(DIFFIO_RX_B59p,_DIFFOUT_B59p,_DQS6B,_DQS1B,_B_DQS_2,_B_DQS_2))
ddr_dqs3_n: D5.W17(IO,_(DIFFIO_RX_B67n,_DIFFOUT_B67n,_DQSn7B,_DQ2B,_B_DQS#_3,_B_DQS#_3))
ddr_dqs3_p: D5.W16(IO,_(DIFFIO_RX_B67p,_DIFFOUT_B67p,_DQS7B,_DQ2B,_B_DQS_3,_B_DQS_3))
ddr_odt: D5.AD13(IO,_(DIFFIO_TX_B44p,_DIFFOUT_B44p,__,__,_B_ODT_0,_B_ODT_0))
ddr_ras: D5.Y10(IO,_(DIFFIO_TX_B32n,_DIFFOUT_B32n,_DQ2B,__,_B_RAS#))
ddr_reset_n: D5.AE19(IO,_(DIFFIO_TX_B60p,_DIFFOUT_B60p,__,__,_B_RESET#,_B_RESET#))
ddr_we: D5.T9(IO,_(DIFFIO_TX_B25p,_DIFFOUT_B25p,_DQ2B,__,_B_WE#))
NetD5_AE11: D5.AE11(IO,_RZQ_0,_(DIFFIO_TX_B41n,_DIFFOUT_B41n)) R75.1

Not connected (* = marked no-connect by the designer): D5 AA18(IO,_(DIFFIO_RX_B74n,_DIFFOUT_B74n,_DQ8B,_DQ2B,_B_DQ_32,_B_DQ_32)) AA21(IO,_(DIFFIO_TX_B80n,_DIFFOUT_B80n,_DQ8B,_DQ2B,_B_DQ_39,_B_DQ_39)) AB19(IO,_(DIFFIO_TX_B77p,_DIFFOUT_B77p,_DQ8B,_DQ2B,_B_DQ_38,_B_DQ_38)) AB22(IO,_(DIFFIO_TX_B80p,_DIFFOUT_B80p,_DQ8B,_DQ2B,_B_DM_4,_B_DM_4)) AE10(IO,_(DIFFIO_TX_B45n,_DIFFOUT_B45n,_DQ4B,__,_B_ODT_1,_B_ODT_1)) AE13(IO,_(DIFFIO_TX_B52p,_DIFFOUT_B52p,__,__,_B_CKE_1,_B_CKE_1)) AE25(IO,_(DIFFIO_TX_B73p,_DIFFOUT_B73p,_DQ8B,_DQ2B,_B_DQ_34,_B_DQ_34)) AE26(IO,_(DIFFIO_TX_B76n,_DIFFOUT_B76n,_DQ8B,_DQ2B,_B_DQ_35,_B_DQ_35)) P11(IO,_CLK1p,_(DIFFIO_RX_B39p,_DIFFOUT_B39p)) P12(IO,_CLK1n,_(DIFFIO_RX_B39n,_DIFFOUT_B39n)) T11(IO,_(DIFFIO_RX_B27n,_DIFFOUT_B27n,_DQSn2B,__,_B_CS#_1,_B_CS#_1)) T12(IO,_CLK0n,_FPLL_BL_FBn,_(DIFFIO_RX_B31n,_DIFFOUT_B31n)) T13(IO,_CLK0p,_FPLL_BL_FBp,_(DIFFIO_RX_B31p,_DIFFOUT_B31p)) U12(IO,_CLK2p,_(DIFFIO_RX_B47p,_DIFFOUT_B47p)) V12(IO,_CLK2n,_(DIFFIO_RX_B47n,_DIFFOUT_B47n)) V17(IO,_(DIFFIO_RX_B75n,_DIFFOUT_B75n,_DQSn8B,_DQSn2B,_B_DQS#_4,_B_DQS#_4)) V18(IO,_(DIFFIO_RX_B75p,_DIFFOUT_B75p,_DQS8B,_DQS2B,_B_DQS_4,_B_DQS_4)) Y11(IO,_(DIFFIO_RX_B26n,_DIFFOUT_B26n,_DQ2B,__,_B_A_15)) Y15(IO,_CLK3p,_(DIFFIO_RX_B55p,_DIFFOUT_B55p)) Y16(IO,_CLK3n,_(DIFFIO_RX_B55n,_DIFFOUT_B55n)) Y18(IO,_(DIFFIO_RX_B74p,_DIFFOUT_B74p,_DQ8B,_DQ2B,_B_DQ_33,_B_DQ_33)) Y19(IO,_(DIFFIO_RX_B78n,_DIFFOUT_B78n,_DQ8B,_DQ2B,_B_DQ_36,_B_DQ_36)) Y20(IO,_(DIFFIO_RX_B78p,_DIFFOUT_B78p,_DQ8B,_DQ2B,_B_DQ_37,_B_DQ_37))

### Notes on the sheet
- Title
- Size:
- Date:
- A3
- Number:
- Time:
- Revision:
- Sheet
- of
- File:
- (in symbol 5CEFA7F27C8N, part B) BANK 3B
- (in symbol 5CEFA7F27C8N, part C) BANK 4A

### Library data of the parts
D5 = 5CEFA7F27C8N: as D5 on sheet as14120_fpga_ttl; DatasheetVersion: Rev. 3.1; PackageReference: 672-FBGA-2000A; PackageDescription: 672-Pin FineLine Ball-Grid Array (FBGA), Body 27 x 27 mm, Pitch 1 mm; Supplier 1: Digi-Key; Supplier Part Number 1: 5CEFA7F27C8N-ND; Supplier 2: Mouser; Supplier Part Number 2: 989-5CEFA7F27C8N; RoHS: RoHS Compliant; Subcategory: Cyclone V E; Voltage Supply: 1.07 to 1.13 V; Mounting Technology: Surface Mount; Code_JEDEC: MS-034-AAL-1; PartNumber: 5CEFA7F27C8N; ComponentLink1Description: Manufacturer URL; ComponentLink1URL: http://www.altera.com; ComponentLink2Description: Datasheet; ComponentLink2URL: http://www.altera.com/literature/hb/cyclone-v/cv_51002.pdf; ComponentLink3Description: Package Specification; ComponentLink3URL: http://www.altera.com/devicepackaging/04R00427-01.pdf; ComponentLink4Description: Device Handbook URL; ComponentLink4URL: http://www.altera.com/literature/hb/cyclone-v/cyclone5_handbook.pdf; ComponentLink5Description: Device Overview URL; ComponentLink5URL: http://www.altera.com/literature/hb/cyclone-v/cv_51001.pdf; ComponentLink6Description: Device Pin-Out URL; ComponentLink6URL: http://www.altera.com/literature/dp/cyclone-v/1.1.txt; ComponentLink7Description: Product URL; ComponentLink7URL: http://www.buyaltera.com/scripts/partsearch.dll?Detail&name=5CEFA7F27C8N-ND
R75 = RES_0805: as R1 on sheet as14120_usb; Tolerance: 1 %; Power: 0.125 W; Technology: SMT